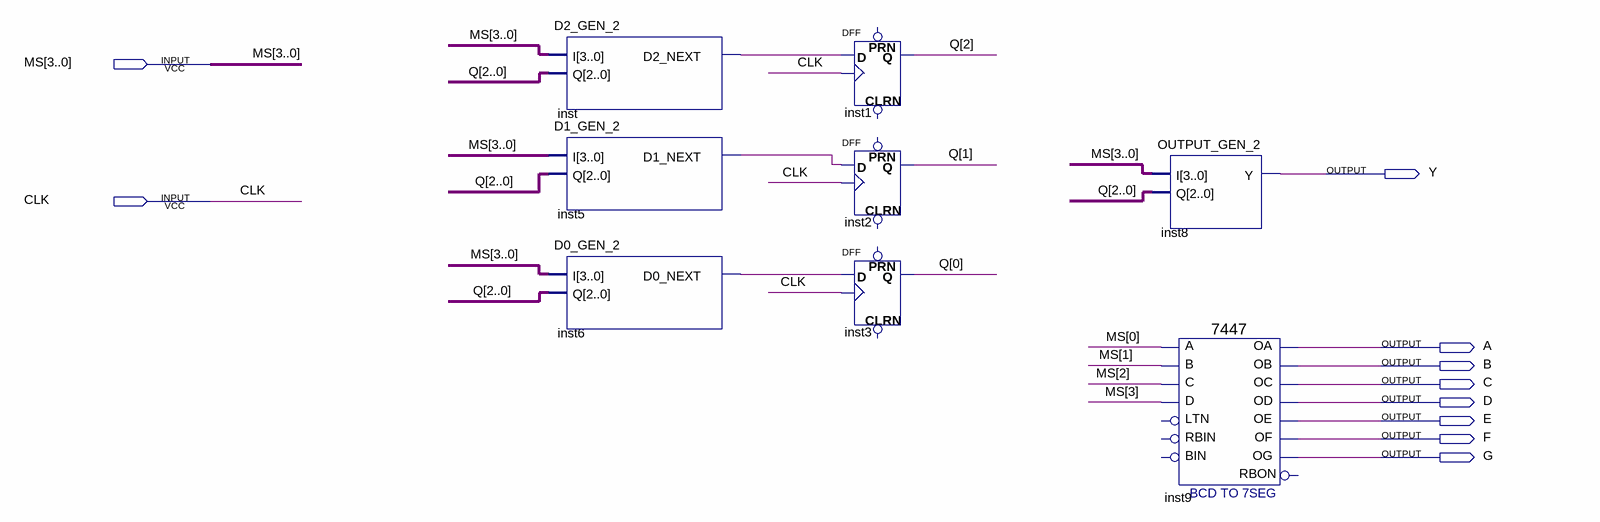
[diagram p0: schematic sheet]
// Quartus schematic MSSV_Detection_2.bdf as structural Verilog: 8 symbols, 10 pins
module MSSV_Detection_2 (
  input  [3:0] MS,
  input  CLK,
  output Y,
  output A,
  output B,
  output C,
  output D,
  output E,
  output F,
  output G
);

  wire inst5_d1_next, inst6_d0_next, inst_d2_next;
  wire [2:0] Q;

  D2_GEN_2 inst (.I(MS), .Q(Q), .D2_NEXT(inst_d2_next));
  D1_GEN_2 inst5 (.I(MS), .Q(Q), .D1_NEXT(inst5_d1_next));
  D0_GEN_2 inst6 (.I(MS), .Q(Q), .D0_NEXT(inst6_d0_next));
  DFF inst1 (.CLK(CLK), .D(inst_d2_next), .Q(Q[2]));  // open: CLRN, PRN
  DFF inst2 (.CLK(CLK), .D(inst5_d1_next), .Q(Q[1]));  // open: CLRN, PRN
  DFF inst3 (.CLK(CLK), .D(inst6_d0_next), .Q(Q[0]));  // open: CLRN, PRN
  OUTPUT_GEN_2 inst8 (.I(MS), .Q(Q), .Y(Y));
  \7447  inst9 (
    .B(MS[1]), .C(MS[2]), .D(MS[3]), .A(MS[0]), .OB(B), .OC(C), .OE(E), .OD(D), .OF(F), .OG(G), .OA(A));  // open: LTN, RBIN, BIN, RBON
endmodule
